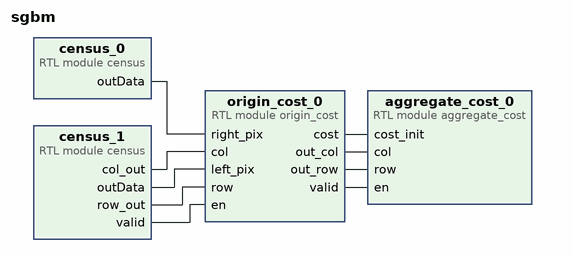
[diagram p0: block diagram of the top level]
# Vivado block design sgbm, xczu48dr-fsvg1517-2-e, Vivado 2021.2
create_bd_design sgbm

create_bd_cell -type module -reference aggregate_cost aggregate_cost_0
create_bd_cell -type module -reference census census_0
create_bd_cell -type module -reference origin_cost origin_cost_0
create_bd_cell -type module -reference census census_1

# ---- connections ----

connect_bd_net [get_bd_pins census_0/outData] [get_bd_pins origin_cost_0/right_pix]
connect_bd_net [get_bd_pins census_1/col_out] [get_bd_pins origin_cost_0/col]
connect_bd_net [get_bd_pins census_1/outData] [get_bd_pins origin_cost_0/left_pix]
connect_bd_net [get_bd_pins census_1/row_out] [get_bd_pins origin_cost_0/row]
connect_bd_net [get_bd_pins census_1/valid] [get_bd_pins origin_cost_0/en]
connect_bd_net [get_bd_pins origin_cost_0/cost] [get_bd_pins aggregate_cost_0/cost_init]
connect_bd_net [get_bd_pins origin_cost_0/out_col] [get_bd_pins aggregate_cost_0/col]
connect_bd_net [get_bd_pins origin_cost_0/out_row] [get_bd_pins aggregate_cost_0/row]
connect_bd_net [get_bd_pins origin_cost_0/valid] [get_bd_pins aggregate_cost_0/en]

validate_bd_design
save_bd_design
